# Altium schematic sheet COMS0004_3_RadioMux.SchDoc: BLUEsat Switching Circuit
size A3; Engineer: D. JEDRYCHOWSKI; Organization: BLUEsat Project; Address1: Room 419; Address2: School of EE&T; Address3: UNSW, NSW 2052; Address4: Australia; DocumentNumber: COMS0004; SheetNumber: 3; SheetTotal: 4; Description: Selects the transmitter and reciever radios to be used; Version: 1.0
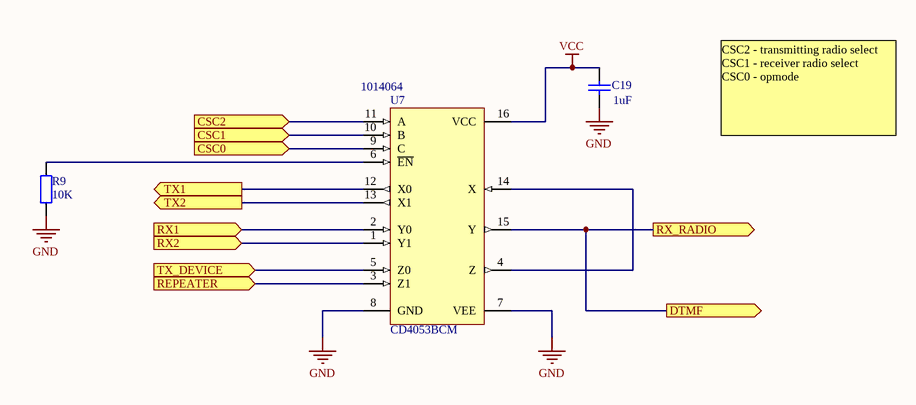
[diagram p0: COMS0004_3_RadioMux.SchDoc]

## Parts
C19  value 1uF  [0805]  (hidden comment: C1210)
R9  value 10K  [RESC2012N]  (hidden comment: Res1)
U7  CD4053BCM  Supplier Part Number 1: 1014064  [M16A_M]

## Ports
CSC0 (in), CSC1 (in), CSC2 (in), DTMF (out), REPEATER (in), RX1 (in), RX2 (in), RX_RADIO (out), TX1 (out), TX2 (out), TX_DEVICE (in)

## Nets
GND: C19.1 R9.2 U7.7(VEE) U7.8(GND)
VCC: C19.2 U7.16(VCC)
CSC0: U7.9(C) ; port CSC0
CSC1: U7.10(B) ; port CSC1
CSC2: U7.11(A) ; port CSC2
DTMF: U7.15(Y) ; port RX_RADIO, port DTMF
REPEATER: U7.3(Z1) ; port REPEATER
RX1: U7.2(Y0) ; port RX1
RX2: U7.1(Y1) ; port RX2
TX1: U7.12(X0) ; port TX1
TX2: U7.13(X1) ; port TX2
TX_DEVICE: U7.5(Z0) ; port TX_DEVICE
NetR9_1: R9.1 U7.6(~{EN})
NetU7_4: U7.4(Z) U7.14(X)

## Notes on the sheet
- CSC2 - transmitting radio select
  CSC1 - receiver radio select
  CSC0 - opmode
- Title
- Description:
- Size:
- Author:
- Date:
- A3
- Time:
- Version
- Sheet:
- Drawing No.:
- of
- File:

## Library data of the parts
C19 = Cap: Capacitor; Published: 8-Jun-2000; LatestRevisionDate: 17-Jul-2002; LatestRevisionNote: Re-released for DXP Platform.; PackageReference: RAD-0.3; Publisher: Altium Limited; PackageDescription: Radial Cap, Thru-Hole; 2 Leads; 0.3 in Pin Spacing; Supplier 1: Farnell; Supplier Part Number 1: 1637035
R9 = Res2: Resistor; Published: 8-Jun-2000; LatestRevisionDate: 17-Jul-2002; LatestRevisionNote: Re-released for DXP Platform.; PackageReference: AXIAL-0.4; Publisher: Altium Limited; PackageDescription: Axial Device, Thru-Hole; 2 Leads; 0.4 in Pin Spacing; Supplier 1: Farnell; Supplier Part Number 1: 1811779
U7 = CD4053BCM: Triple 2-Channnel Analog Multiplexer/Demutiplexer; Published: 17-Jul-2002; LatestRevisionDate: 13-Apr-2006; LatestRevisionNote: IPC-7351 Footprint Added.; DatasheetVersion: Jan-1999; PackageVersion: 2000; PackageReference: M16A; Publisher: Altium Limited; PackageDescription: 16-Pin Small Outline Integrated Circuit 1.27 mm Pitch; ComponentLink1Description: Manufacturer Link; ComponentLink1URL: http://www.fairchildsemi.com/; ComponentLink2Description: Datasheet; ComponentLink2URL: http://www.fairchildsemi.com/ds/CD%2FCD4052BC.pdf; Code_IPC: SOIC127P600-16; Supplier 1: Farnell